# Altium project sonar.PrjPCB
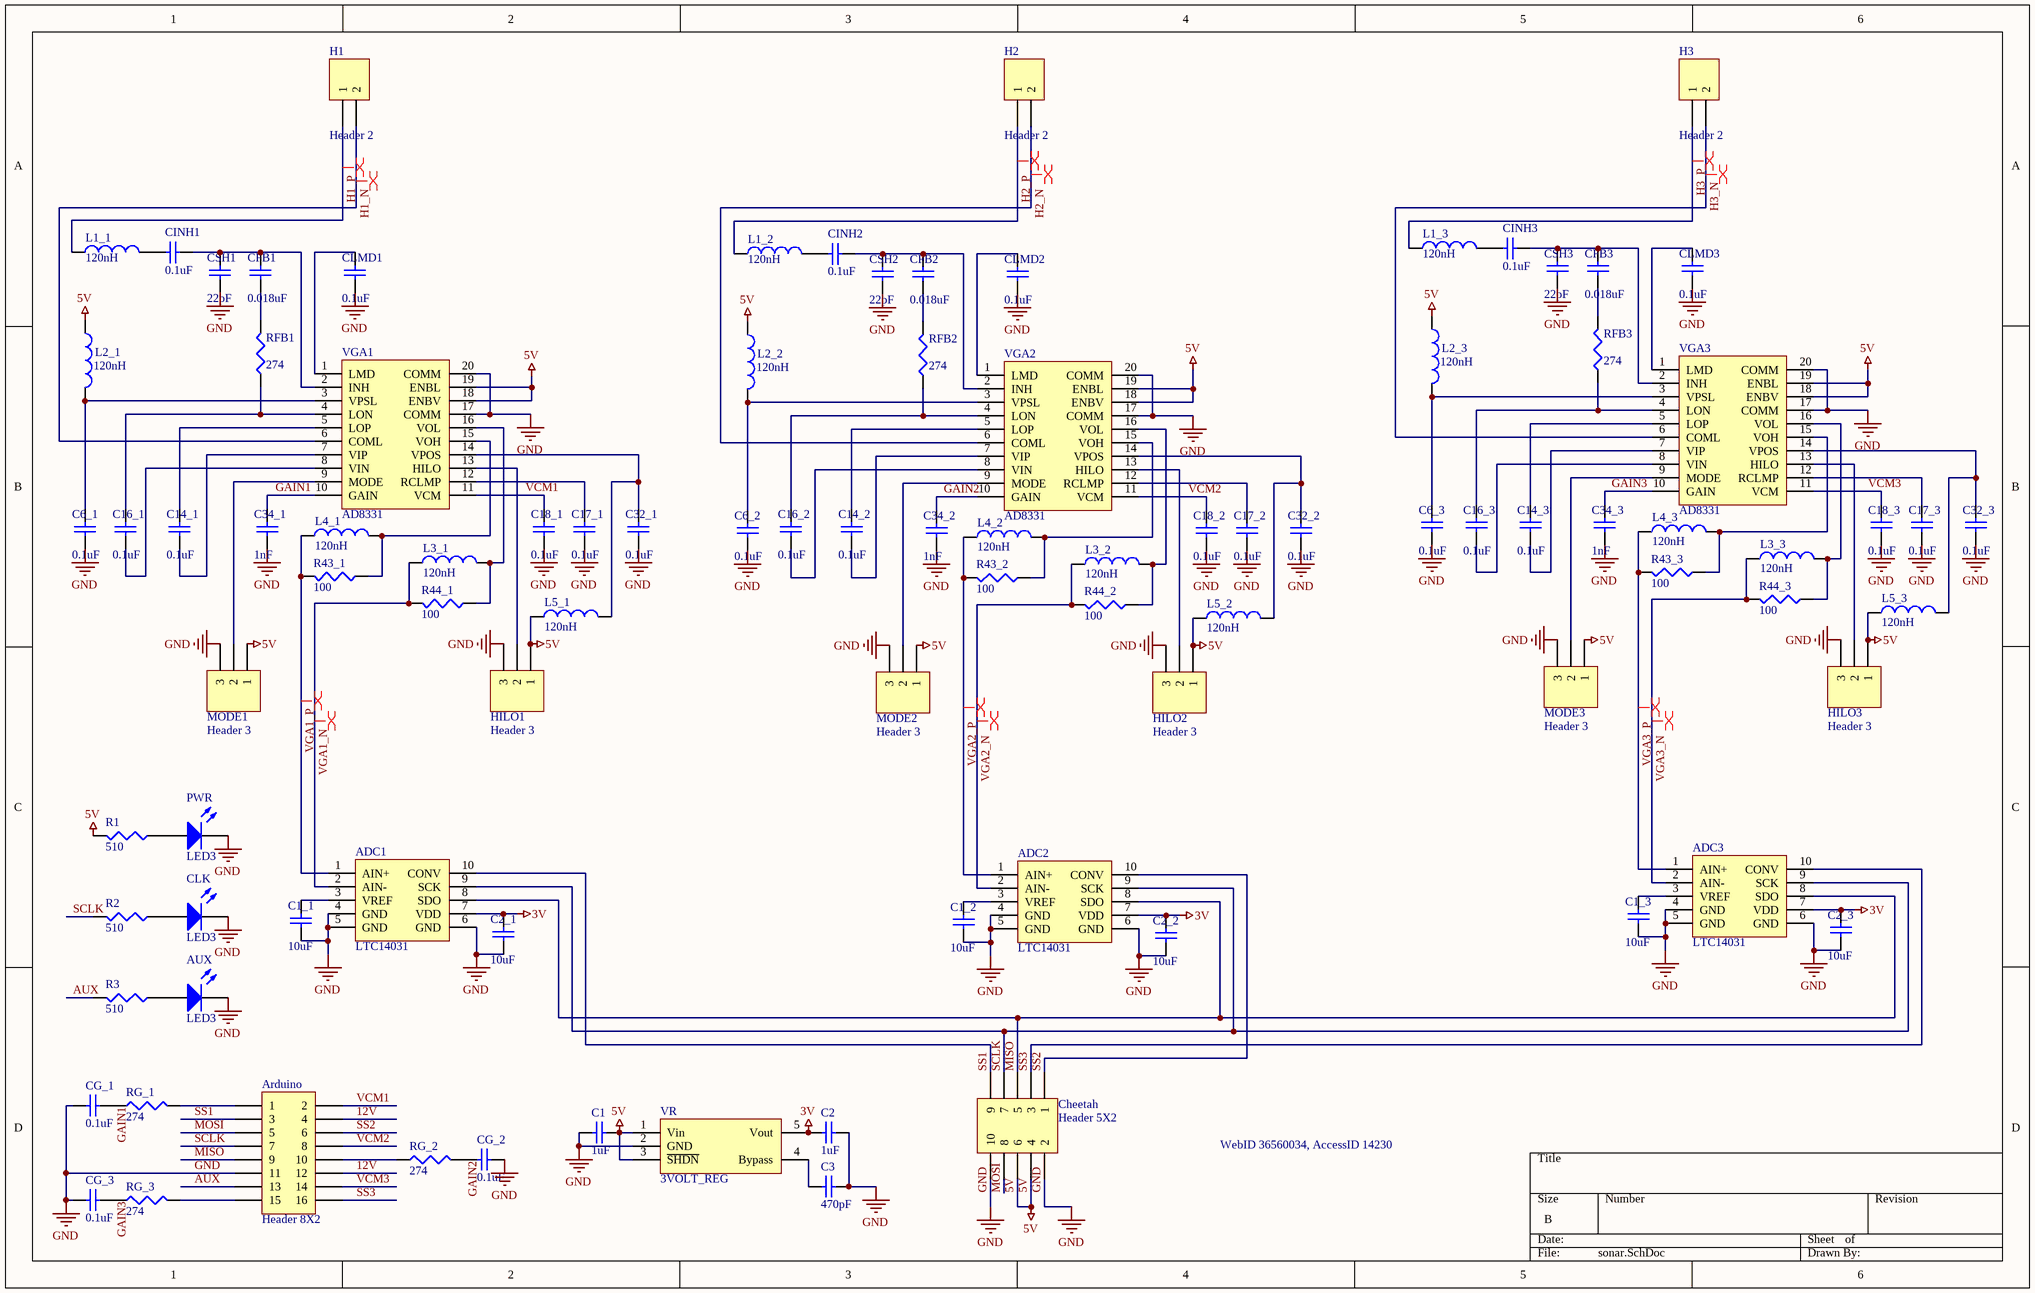
[diagram p0: sonar.SchDoc]
1 sheet, 96 parts. Net scope: global (net labels, ports and power ports of the same name join across sheets).
Board file: sonar.PcbDoc

## Sheet sonar.SchDoc
size B

### Parts
ADC1  LTC14031  [ADC]
ADC2  LTC14031  [ADC]
ADC3  LTC14031  [ADC]
Arduino  Header 8X2  [HDR2X8]
AUX  LED3  [LED]
C1  value 1uF  [cap_vreg_1uf]  (hidden comment: Cap)
C1_1  value 10uF  [cap_adc_10uf]  (hidden comment: Cap)
C1_2  value 10uF  [cap_adc_10uf]  (hidden comment: Cap)
C1_3  value 10uF  [cap_adc_10uf]  (hidden comment: Cap)
C2  value 1uF  [cap_vreg_1uf]  (hidden comment: Cap)
C2_1  value 10uF  [cap_adc_10uf]  (hidden comment: Cap)
C2_2  value 10uF  [cap_adc_10uf]  (hidden comment: Cap)
C2_3  value 10uF  [cap_adc_10uf]  (hidden comment: Cap)
C3  value 470pF  [CAP_VREG_470PF]  (hidden comment: Cap)
C6_1  value 0.1uF  [CAP_VGA_01UF]  (hidden comment: Cap)
C6_2  value 0.1uF  [CAP_VGA_01UF]  (hidden comment: Cap)
C6_3  value 0.1uF  [CAP_VGA_01UF]  (hidden comment: Cap)
C14_1  value 0.1uF  [CAP_VGA_01UF]  (hidden comment: Cap)
C14_2  value 0.1uF  [CAP_VGA_01UF]  (hidden comment: Cap)
C14_3  value 0.1uF  [CAP_VGA_01UF]  (hidden comment: Cap)
C16_1  value 0.1uF  [CAP_VGA_01UF]  (hidden comment: Cap)
C16_2  value 0.1uF  [CAP_VGA_01UF]  (hidden comment: Cap)
C16_3  value 0.1uF  [CAP_VGA_01UF]  (hidden comment: Cap)
C17_1  value 0.1uF  [CAP_VGA_01UF]  (hidden comment: Cap)
C17_2  value 0.1uF  [CAP_VGA_01UF]  (hidden comment: Cap)
C17_3  value 0.1uF  [CAP_VGA_01UF]  (hidden comment: Cap)
C18_1  value 0.1uF  [CAP_VGA_01UF]  (hidden comment: Cap)
C18_2  value 0.1uF  [CAP_VGA_01UF]  (hidden comment: Cap)
C18_3  value 0.1uF  [CAP_VGA_01UF]  (hidden comment: Cap)
C32_1  value 0.1uF  [CAP_VGA_01UF]  (hidden comment: Cap)
C32_2  value 0.1uF  [CAP_VGA_01UF]  (hidden comment: Cap)
C32_3  value 0.1uF  [CAP_VGA_01UF]  (hidden comment: Cap)
C34_1  value 1nF  [CAP_VGA_01UF]  (hidden comment: Cap)
C34_2  value 1nF  [CAP_VGA_01UF]  (hidden comment: Cap)
C34_3  value 1nF  [CAP_VGA_01UF]  (hidden comment: Cap)
CFB1  value 0.018uF  [CAP_VGA_01UF]  (hidden comment: Cap)
CFB2  value 0.018uF  [CAP_VGA_01UF]  (hidden comment: Cap)
CFB3  value 0.018uF  [CAP_VGA_01UF]  (hidden comment: Cap)
CG_1  value 0.1uF  [CAP_VGA_01UF]  (hidden comment: Cap)
CG_2  value 0.1uF  [CAP_VGA_01UF]  (hidden comment: Cap)
CG_3  value 0.1uF  [CAP_VGA_01UF]  (hidden comment: Cap)
Cheetah  Header 5X2  [HDR2X5]
CINH1  value 0.1uF  [CAP_VGA_01UF]  (hidden comment: Cap)
CINH2  value 0.1uF  [CAP_VGA_01UF]  (hidden comment: Cap)
CINH3  value 0.1uF  [CAP_VGA_01UF]  (hidden comment: Cap)
CLK  LED3  [LED]
CLMD1  value 0.1uF  [CAP_VGA_01UF]  (hidden comment: Cap)
CLMD2  value 0.1uF  [CAP_VGA_01UF]  (hidden comment: Cap)
CLMD3  value 0.1uF  [CAP_VGA_01UF]  (hidden comment: Cap)
CSH1  value 22pF  [CAP_VGA_01UF]  (hidden comment: Cap)
CSH2  value 22pF  [CAP_VGA_01UF]  (hidden comment: Cap)
CSH3  value 22pF  [CAP_VGA_01UF]  (hidden comment: Cap)
H1  Header 2  [bnc]
H2  Header 2  [bnc]
H3  Header 2  [bnc]
HILO1  Header 3  [HDR1X3]
HILO2  Header 3  [HDR1X3]
HILO3  Header 3  [HDR1X3]
L1_1  value 120nH  [ind_vga_120nh]  (hidden comment: FB Inductor)
L1_2  value 120nH  [ind_vga_120nh]  (hidden comment: FB Inductor)
L1_3  value 120nH  [ind_vga_120nh]  (hidden comment: FB Inductor)
L2_1  value 120nH  [ind_vga_120nh]  (hidden comment: FB Inductor)
L2_2  value 120nH  [ind_vga_120nh]  (hidden comment: FB Inductor)
L2_3  value 120nH  [ind_vga_120nh]  (hidden comment: FB Inductor)
L3_1  value 120nH  [ind_vga_120nh]  (hidden comment: FB Inductor)
L3_2  value 120nH  [ind_vga_120nh]  (hidden comment: FB Inductor)
L3_3  value 120nH  [ind_vga_120nh]  (hidden comment: FB Inductor)
L4_1  value 120nH  [ind_vga_120nh]  (hidden comment: FB Inductor)
L4_2  value 120nH  [ind_vga_120nh]  (hidden comment: FB Inductor)
L4_3  value 120nH  [ind_vga_120nh]  (hidden comment: FB Inductor)
L5_1  value 120nH  [ind_vga_120nh]  (hidden comment: FB Inductor)
L5_2  value 120nH  [ind_vga_120nh]  (hidden comment: FB Inductor)
L5_3  value 120nH  [ind_vga_120nh]  (hidden comment: FB Inductor)
MODE1  Header 3  [HDR1X3]
MODE2  Header 3  [HDR1X3]
MODE3  Header 3  [HDR1X3]
PWR  LED3  [LED]
R1  value 510  [res_vga_274]  (hidden comment: Res3)
R2  value 510  [res_vga_274]  (hidden comment: Res3)
R3  value 510  [res_vga_274]  (hidden comment: Res3)
R43_1  value 100  [res_vga_274]  (hidden comment: Res3)
R43_2  value 100  [res_vga_274]  (hidden comment: Res3)
R43_3  value 100  [res_vga_274]  (hidden comment: Res3)
R44_1  value 100  [res_vga_274]  (hidden comment: Res3)
R44_2  value 100  [res_vga_274]  (hidden comment: Res3)
R44_3  value 100  [res_vga_274]  (hidden comment: Res3)
RFB1  value 274  [res_vga_274]  (hidden comment: Res3)
RFB2  value 274  [res_vga_274]  (hidden comment: Res3)
RFB3  value 274  [res_vga_274]  (hidden comment: Res3)
RG_1  value 274  [res_vga_274]  (hidden comment: Res3)
RG_2  value 274  [res_vga_274]  (hidden comment: Res3)
RG_3  value 274  [res_vga_274]  (hidden comment: Res3)
VGA1  AD8331  [VGA]
VGA2  AD8331  [VGA]
VGA3  AD8331  [VGA]
VR  3VOLT_REG  [3VOLT_REG]

### Nets
3V: ADC1.7(VDD) ADC2.7(VDD) ADC3.7(VDD) C2.2 C2_1.2 C2_2.2 C2_3.2 VR.5(Vout)
5V: C1.1 Cheetah.4 Cheetah.6 HILO1.1 HILO2.1 HILO3.1 L2_1.1 L2_2.1 L2_3.1 L5_1.1 L5_2.1 L5_3.1 MODE1.1 MODE2.1 MODE3.1 R1.2 VGA1.18(ENBV) VGA1.19(ENBL) VGA2.18(ENBV) VGA2.19(ENBL) VGA3.18(ENBV) VGA3.19(ENBL) VR.1(Vin) VR.3(~{SHDN})
GND: ADC1.4(GND) ADC1.5(GND) ADC1.6(GND) ADC2.4(GND) ADC2.5(GND) ADC2.6(GND) ADC3.4(GND) ADC3.5(GND) ADC3.6(GND) Arduino.11 AUX.2(K) C1.2 C1_1.1 C1_2.1 C1_3.1 C2.1 C2_1.1 C2_2.1 C2_3.1 C3.1 C6_1.1 C6_2.1 C6_3.1 C17_1.1 C17_2.1 C17_3.1 C18_1.1 C18_2.1 C18_3.1 C32_1.1 C32_2.1 C32_3.1 C34_1.1 C34_2.1 C34_3.1 CG_1.1 CG_2.2 CG_3.2 Cheetah.2 Cheetah.10 CLK.2(K) CLMD1.1 CLMD2.1 CLMD3.1 CSH1.1 CSH2.1 CSH3.1 HILO1.3 HILO2.3 HILO3.3 MODE1.3 MODE2.3 MODE3.3 PWR.2(K) VGA1.17(COMM) VGA1.20(COMM) VGA2.17(COMM) VGA2.20(COMM) VGA3.17(COMM) VGA3.20(COMM) VR.2(GND)
12V: Arduino.4 Arduino.12
AUX: Arduino.13 R3.2
GAIN1: C34_1.2 CG_1.2 RG_1.1 VGA1.10(GAIN)
GAIN2: C34_2.2 CG_2.1 RG_2.2 VGA2.10(GAIN)
GAIN3: C34_3.2 CG_3.1 RG_3.1 VGA3.10(GAIN)
H1_N: H1.2 VGA1.6(COML)
H1_P: H1.1 L1_1.1
H2_N: H2.2 VGA2.6(COML)
H2_P: H2.1 L1_2.1
H3_N: H3.2 VGA3.6(COML)
H3_P: H3.1 L1_3.1
MISO: ADC1.8(SDO) ADC2.8(SDO) ADC3.8(SDO) Arduino.9 Cheetah.5
MOSI: Arduino.5 Cheetah.8
SCLK: ADC1.9(SCK) ADC2.9(SCK) ADC3.9(SCK) Arduino.7 Cheetah.7 R2.2
SS1: ADC1.10(CONV) Arduino.3 Cheetah.9
SS2: ADC2.10(CONV) Arduino.6 Cheetah.1
SS3: ADC3.10(CONV) Arduino.16 Cheetah.3
VCM1: Arduino.2 C18_1.2 VGA1.11(VCM)
VCM2: Arduino.8 C18_2.2 VGA2.11(VCM)
VCM3: Arduino.14 C18_3.2 VGA3.11(VCM)
VGA1_N: ADC1.2(AIN-) L3_1.1 R44_1.2
VGA1_P: ADC1.1(AIN+) L4_1.1 R43_1.2
VGA2_N: ADC2.2(AIN-) L3_2.1 R44_2.2
VGA2_P: ADC2.1(AIN+) L4_2.1 R43_2.2
VGA3_N: ADC3.2(AIN-) L3_3.1 R44_3.2
VGA3_P: ADC3.1(AIN+) L4_3.1 R43_3.2
NetADC1_3: ADC1.3(VREF) C1_1.2
NetADC2_3: ADC2.3(VREF) C1_2.2
NetADC3_3: ADC3.3(VREF) C1_3.2
NetArduino_1: Arduino.1 RG_1.2
NetArduino_10: Arduino.10 RG_2.1
NetArduino_15: Arduino.15 RG_3.2
NetAUX_1: AUX.1(A) R3.1
NetC3_2: C3.2 VR.4(Bypass)
NetC6_1_2: C6_1.2 L2_1.2 VGA1.3(VPSL)
NetC6_2_2: C6_2.2 L2_2.2 VGA2.3(VPSL)
NetC6_3_2: C6_3.2 L2_3.2 VGA3.3(VPSL)
NetC14_1_1: C14_1.1 VGA1.7(VIP)
NetC14_1_2: C14_1.2 VGA1.5(LOP)
NetC14_2_1: C14_2.1 VGA2.7(VIP)
NetC14_2_2: C14_2.2 VGA2.5(LOP)
NetC14_3_1: C14_3.1 VGA3.7(VIP)
NetC14_3_2: C14_3.2 VGA3.5(LOP)
NetC16_1_1: C16_1.1 VGA1.8(VIN)
NetC16_1_2: C16_1.2 RFB1.1 VGA1.4(LON)
NetC16_2_1: C16_2.1 VGA2.8(VIN)
NetC16_2_2: C16_2.2 RFB2.1 VGA2.4(LON)
NetC16_3_1: C16_3.1 VGA3.8(VIN)
NetC16_3_2: C16_3.2 RFB3.1 VGA3.4(LON)
NetC17_1_2: C17_1.2 VGA1.12(RCLMP)
NetC17_2_2: C17_2.2 VGA2.12(RCLMP)
NetC17_3_2: C17_3.2 VGA3.12(RCLMP)
NetC32_1_2: C32_1.2 L5_1.2 VGA1.14(VPOS)
NetC32_2_2: C32_2.2 L5_2.2 VGA2.14(VPOS)
NetC32_3_2: C32_3.2 L5_3.2 VGA3.14(VPOS)
NetCFB1_1: CFB1.1 RFB1.2
NetCFB1_2: CFB1.2 CINH1.1 CSH1.2 VGA1.2(INH)
NetCFB2_1: CFB2.1 RFB2.2
NetCFB2_2: CFB2.2 CINH2.1 CSH2.2 VGA2.2(INH)
NetCFB3_1: CFB3.1 RFB3.2
NetCFB3_2: CFB3.2 CINH3.1 CSH3.2 VGA3.2(INH)
NetCINH1_2: CINH1.2 L1_1.2
NetCINH2_2: CINH2.2 L1_2.2
NetCINH3_2: CINH3.2 L1_3.2
NetCLK_1: CLK.1(A) R2.1
NetCLMD1_2: CLMD1.2 VGA1.1(LMD)
NetCLMD2_2: CLMD2.2 VGA2.1(LMD)
NetCLMD3_2: CLMD3.2 VGA3.1(LMD)
NetHILO1_2: HILO1.2 VGA1.13(HILO)
NetHILO2_2: HILO2.2 VGA2.13(HILO)
NetHILO3_2: HILO3.2 VGA3.13(HILO)
NetL3_1_2: L3_1.2 R44_1.1 VGA1.16(VOL)
NetL3_2_2: L3_2.2 R44_2.1 VGA2.16(VOL)
NetL3_3_2: L3_3.2 R44_3.1 VGA3.16(VOL)
NetL4_1_2: L4_1.2 R43_1.1 VGA1.15(VOH)
NetL4_2_2: L4_2.2 R43_2.1 VGA2.15(VOH)
NetL4_3_2: L4_3.2 R43_3.1 VGA3.15(VOH)
NetMODE1_2: MODE1.2 VGA1.9(MODE)
NetMODE2_2: MODE2.2 VGA2.9(MODE)
NetMODE3_2: MODE3.2 VGA3.9(MODE)
NetPWR_1: PWR.1(A) R1.1

### Layout directives
differential pair: H1_N, H1_P, H2_N, H2_P, H3_N, H3_P, VGA1_N, VGA1_P, VGA2_N, VGA2_P, VGA3_N, VGA3_P

### Notes on the sheet
- WebID 36560034, AccessID 14230

### Library data of the parts
ADC1-ADC3 = ADC
Arduino = Header 8X2: Header, 8-Pin, Dual row; LatestRevisionDate: 17-Jul-2002; LatestRevisionNote: Re-released for DXP Platform.; Publisher: Altium Limited
AUX CLK PWR = LED3: Typical BLUE SiC LED; Published: 8-Jun-2000; LatestRevisionDate: 17-Dec-2003; LatestRevisionNote: PCB Footprint replaced.; DatasheetDocument: 16-Apr-2002; PackageDocument: 16-Apr-2002; PackageReference: 3.5X2.8X1.9; Publisher: Altium Limited
C1 C1_1-C1_3 C2 C2_1-C2_3 C3 C6_1-C6_3 C14_1-C14_3 C16_1-C16_3 C17_1-C17_3 C18_1-C18_3 C32_1-C32_3 C34_1-C34_3 CFB1-CFB3 CG_1-CG_3 CINH1-CINH3 CLMD1-CLMD3 CSH1-CSH3 = Cap: Capacitor; Published: 8-Jun-2000; LatestRevisionDate: 17-Jul-2002; LatestRevisionNote: Re-released for DXP Platform.; PackageReference: RAD-0.3; Publisher: Altium Limited
Cheetah = Header 5X2: Header, 5-Pin, Dual row; LatestRevisionDate: 17-Jul-2002; LatestRevisionNote: Re-released for DXP Platform.; Publisher: Altium Limited
H1-H3 = Header 2: Header, 2-Pin; LatestRevisionDate: 17-Jul-2002; LatestRevisionNote: Re-released for DXP Platform.; Publisher: Altium Limited
HILO1-HILO3 MODE1-MODE3 = Header 3: Header, 3-Pin; LatestRevisionDate: 17-Jul-2002; LatestRevisionNote: Re-released for DXP Platform.; Publisher: Altium Limited
L1_1-L1_3 L2_1-L2_3 L3_1-L3_3 L4_1-L4_3 L5_1-L5_3 = Inductor: Code_IEC: 1005; Published: 8-Jun-2000; LatestRevisionDate: 17-Jul-2002; LatestRevisionNote: Re-released for DXP Platform.; PackageReference: 0402-A; Publisher: Altium Limited; Code_JEITA: 0402
R1-R3 R43_1-R43_3 R44_1-R44_3 RFB1-RFB3 RG_1-RG_3 = Res3: Resistor; Published: 8-Jun-2000; LatestRevisionDate: 04-Mar-2005; LatestRevisionNote: PCB Footprint replaced.; PackageReference: J1-0603; Publisher: Altium Limited
VGA1-VGA3 = VGA